# Altium schematic sheet Arduino FPGA Top-Level Interface.SchDoc
size A4
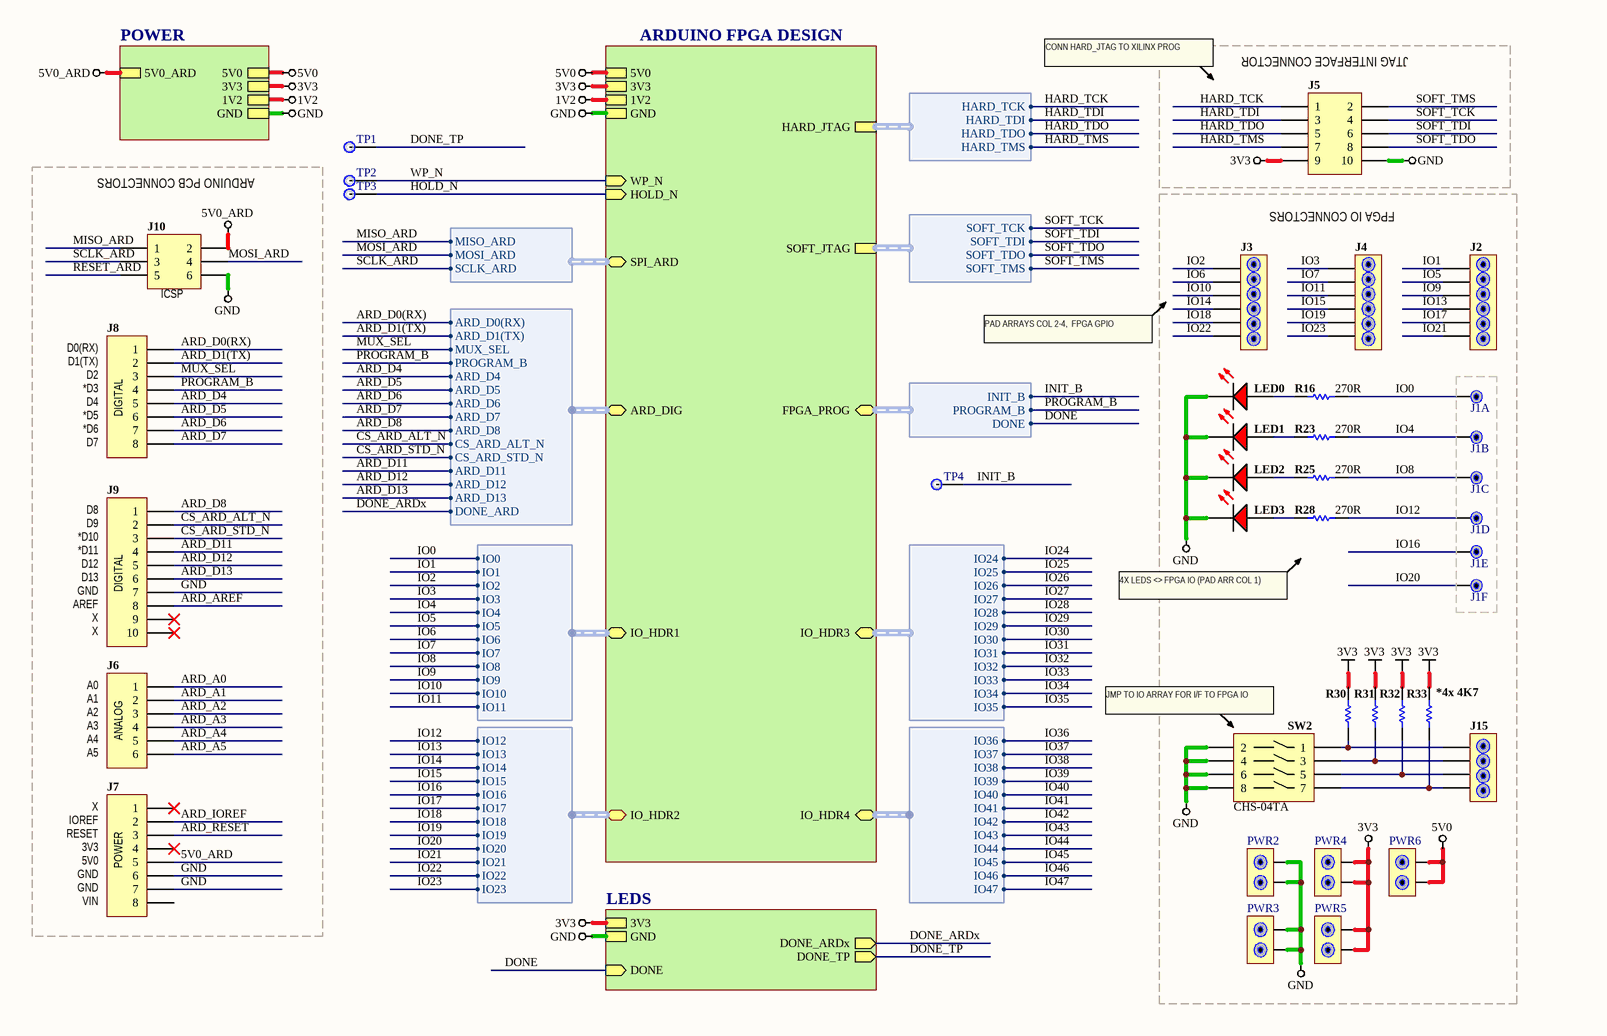
[diagram p0: Arduino FPGA Top-Level Interface.SchDoc]

## Parts
J1  HDR1X6X1  [HDR1X6]  (value not drawn)  (parts A,B,C,D,E,F of 6)
J2  6-POS VERTICAL HEADER  [HDR1X6]  (value not drawn)
J3  6-POS VERTICAL HEADER  [HDR1X6]  (value not drawn)
J4  6-POS VERTICAL HEADER  [HDR1X6]  (value not drawn)
J5  Header 5X2  [HDR2X5]  (value not drawn)
J6  Header 6  [1X06]  (value not drawn)
J7  Header 8  [1X08]  (value not drawn)
J8  Header 8  [1X08]  (value not drawn)
J9  Header 10  [1X10@1]  (value not drawn)
J10  Header 3X2  [2X03]  (value not drawn)
J15  4-POS VERTICAL HEADER  [HDR1X4]  (value not drawn)
LED0  0402-LED-RED  [LED_0402]  (value not drawn)
LED1  0402-LED-RED  [LED_0402]  (value not drawn)
LED2  0402-LED-RED  [LED_0402]  (value not drawn)
LED3  0402-LED-RED  [LED_0402]  (value not drawn)
PWR2  Jumper  [JMP1X2]  (value not drawn)
PWR3  Jumper  [JMP1X2]  (value not drawn)
PWR4  Jumper  [JMP1X2]  (value not drawn)
PWR5  Jumper  [JMP1X2]  (value not drawn)
PWR6  Jumper  [JMP1X2]  (value not drawn)
R16  value 270R  [RESC0402(1005)40_L]  (hidden comment: 270R 1 0402)
R23  value 270R  [RESC0402(1005)40_L]  (hidden comment: 270R 1 0402)
R25  value 270R  [RESC0402(1005)40_L]  (hidden comment: 270R 1 0402)
R28  value 270R  [RESC0402(1005)40_L]  (hidden comment: 270R 1 0402)
R30  4K7 1 0402  [RESC0402(1005)40_L]  (value not drawn)
R31  4K7 1 0402  [RESC0402(1005)40_L]  (value not drawn)
R32  4K7 1 0402  [RESC0402(1005)40_L]  (value not drawn)
R33  4K7 1 0402  [RESC0402(1005)40_L]  (value not drawn)
SW2  CHS-04TA  [CHS-04A1]
TP1  TESTPOINT_TH  [TESTPOINT_TH]  (value not drawn)
TP2  TESTPOINT_TH  [TESTPOINT_TH]  (value not drawn)
TP3  TESTPOINT_TH  [TESTPOINT_TH]  (value not drawn)
TP4  TESTPOINT_TH  [TESTPOINT_TH]  (value not drawn)

## Blocks framed on the sheet
JTAG INTERFACE CONNECTOR: J5
ARDUINO PCB CONNECTORS: J6-J10
FPGA IO CONNECTORS: J1-J4 J15 LED0-LED3 PWR2-PWR6 R16 R23 R25 R28 R30-R33 SW2

## Sub-sheets
ARDUINO FPGA DESIGN = Arduino FPGA Design.SchDoc: 3V3, GND, 1V2, HARD_JTAG (harness HARD_JTAG), SOFT_JTAG (harness SOFT_JTAG), WP_N (in), HOLD_N (in), IO_HDR2 (harness IO_HDR2), IO_HDR3 (harness IO_HDR3), IO_HDR4 (harness IO_HDR4), IO_HDR1 (harness IO_HDR1), FPGA_PROG (harness FPGA_PROGRAM), SPI_ARD (harness SPI_ARD), 5V0, ARD_DIG (harness ARD_DIG)
LEDS = LEDS - Status.SchDoc: GND, DONE (in), DONE_ARDx (out), DONE_TP (out), 3V3
POWER = Power - 5V0.SchDoc: 5V0, 3V3, 1V2, GND, 5V0_ARD

## Harnesses
HARD_JTAG: HARD_TCK, HARD_TDI, HARD_TDO, HARD_TMS
SOFT_JTAG: SOFT_TCK, SOFT_TDI, SOFT_TDO, SOFT_TMS
FPGA_PROGRAM: INIT_B, PROGRAM_B, DONE
SPI_ARD: MISO_ARD, MOSI_ARD, SCLK_ARD
IO_HDR1: IO0, IO1, IO2, IO3, IO4, IO5, IO6, IO7, IO8, IO9, IO10, IO11
IO_HDR3: IO24, IO25, IO26, IO27, IO28, IO29, IO30, IO31, IO32, IO33, IO34, IO35
IO_HDR4: IO36, IO37, IO38, IO39, IO40, IO41, IO42, IO43, IO44, IO45, IO46, IO47
IO_HDR2: IO12, IO13, IO16, IO17, IO18, IO19, IO20, IO21, IO22, IO23, IO14, IO15
ARD_DIG: ARD_D0(RX), ARD_D1(TX), MUX_SEL, PROGRAM_B, ARD_D4, ARD_D5, ARD_D6, ARD_D7, ARD_D8, CS_ARD_ALT_N, CS_ARD_STD_N, ARD_D11, ARD_D12, ARD_D13, DONE_ARD

## Nets
1V2: sheet ARDUINO FPGA DESIGN/1V2, sheet POWER/1V2
3V3: J5.9 PWR4.1 PWR4.2 PWR5.1 PWR5.2 R30.2 R31.2 R32.2 R33.2 ; sheet ARDUINO FPGA DESIGN/3V3, sheet POWER/3V3, sheet LEDS/3V3
5V0: PWR6.1 PWR6.2 ; sheet ARDUINO FPGA DESIGN/5V0, sheet POWER/5V0
5V0_ARD: J7.5 ; sheet POWER/5V0_ARD
GND: J5.10 J7.6 J7.7 J9.7 J10.6 LED0.2(K) LED1.2(K) LED2.2(K) LED3.2(K) PWR2.1 PWR2.2 PWR3.1 PWR3.2 SW2.2 SW2.4 SW2.6 SW2.8 ; sheet ARDUINO FPGA DESIGN/GND, sheet POWER/GND, sheet LEDS/GND
ARD_A0: J6.1
ARD_A1: J6.2
ARD_A2: J6.3
ARD_A3: J6.4
ARD_A4: J6.5
ARD_A5: J6.6
ARD_AREF: J9.8
ARD_D0(RX): J8.1 ; sheet ARDUINO FPGA DESIGN/ARD_DIG.ARD_D0(RX)
ARD_D1(TX): J8.2 ; sheet ARDUINO FPGA DESIGN/ARD_DIG.ARD_D1(TX)
ARD_D4: J8.5 ; sheet ARDUINO FPGA DESIGN/ARD_DIG.ARD_D4
ARD_D5: J8.6 ; sheet ARDUINO FPGA DESIGN/ARD_DIG.ARD_D5
ARD_D6: J8.7 ; sheet ARDUINO FPGA DESIGN/ARD_DIG.ARD_D6
ARD_D7: J8.8 ; sheet ARDUINO FPGA DESIGN/ARD_DIG.ARD_D7
ARD_D8: J9.1 ; sheet ARDUINO FPGA DESIGN/ARD_DIG.ARD_D8
ARD_D11: J9.4 ; sheet ARDUINO FPGA DESIGN/ARD_DIG.ARD_D11
ARD_D12: J9.5 ; sheet ARDUINO FPGA DESIGN/ARD_DIG.ARD_D12
ARD_D13: J9.6 ; sheet ARDUINO FPGA DESIGN/ARD_DIG.ARD_D13
ARD_IOREF: J7.2
ARD_RESET: J7.3
CS_ARD_ALT_N: J9.2 ; sheet ARDUINO FPGA DESIGN/ARD_DIG.CS_ARD_ALT_N
CS_ARD_STD_N: J9.3 ; sheet ARDUINO FPGA DESIGN/ARD_DIG.CS_ARD_STD_N
DONE: sheet LEDS/DONE, sheet ARDUINO FPGA DESIGN/FPGA_PROG.DONE
DONE_ARDx: sheet LEDS/DONE_ARDx, sheet ARDUINO FPGA DESIGN/ARD_DIG.DONE_ARD
DONE_TP: TP1.1 ; sheet LEDS/DONE_TP
HARD_TCK: J5.1 ; sheet ARDUINO FPGA DESIGN/HARD_JTAG.HARD_TCK
HARD_TDI: J5.3 ; sheet ARDUINO FPGA DESIGN/HARD_JTAG.HARD_TDI
HARD_TDO: J5.5 ; sheet ARDUINO FPGA DESIGN/HARD_JTAG.HARD_TDO
HARD_TMS: J5.7 ; sheet ARDUINO FPGA DESIGN/HARD_JTAG.HARD_TMS
HOLD_N: TP3.1 ; sheet ARDUINO FPGA DESIGN/HOLD_N
INIT_B: TP4.1 ; sheet ARDUINO FPGA DESIGN/FPGA_PROG.INIT_B
IO0: J1.1 R16.2 ; sheet ARDUINO FPGA DESIGN/IO_HDR1.IO0
IO1: J2.1 ; sheet ARDUINO FPGA DESIGN/IO_HDR1.IO1
IO2: J3.1 ; sheet ARDUINO FPGA DESIGN/IO_HDR1.IO2
IO3: J4.1 ; sheet ARDUINO FPGA DESIGN/IO_HDR1.IO3
IO4: J1.2 R23.2 ; sheet ARDUINO FPGA DESIGN/IO_HDR1.IO4
IO5: J2.2 ; sheet ARDUINO FPGA DESIGN/IO_HDR1.IO5
IO6: J3.2 ; sheet ARDUINO FPGA DESIGN/IO_HDR1.IO6
IO7: J4.2 ; sheet ARDUINO FPGA DESIGN/IO_HDR1.IO7
IO8: J1.3 R25.2 ; sheet ARDUINO FPGA DESIGN/IO_HDR1.IO8
IO9: J2.3 ; sheet ARDUINO FPGA DESIGN/IO_HDR1.IO9
IO10: J3.3 ; sheet ARDUINO FPGA DESIGN/IO_HDR1.IO10
IO11: J4.3 ; sheet ARDUINO FPGA DESIGN/IO_HDR1.IO11
IO12: J1.4 R28.2 ; sheet ARDUINO FPGA DESIGN/IO_HDR2.IO12
IO13: J2.4 ; sheet ARDUINO FPGA DESIGN/IO_HDR2.IO13
IO14: J3.4 ; sheet ARDUINO FPGA DESIGN/IO_HDR2.IO14
IO15: J4.4 ; sheet ARDUINO FPGA DESIGN/IO_HDR2.IO15
IO16: J1.5 ; sheet ARDUINO FPGA DESIGN/IO_HDR2.IO16
IO17: J2.5 ; sheet ARDUINO FPGA DESIGN/IO_HDR2.IO17
IO18: J3.5 ; sheet ARDUINO FPGA DESIGN/IO_HDR2.IO18
IO19: J4.5 ; sheet ARDUINO FPGA DESIGN/IO_HDR2.IO19
IO20: J1.6 ; sheet ARDUINO FPGA DESIGN/IO_HDR2.IO20
IO21: J2.6 ; sheet ARDUINO FPGA DESIGN/IO_HDR2.IO21
IO22: J3.6 ; sheet ARDUINO FPGA DESIGN/IO_HDR2.IO22
IO23: J4.6 ; sheet ARDUINO FPGA DESIGN/IO_HDR2.IO23
IO24: sheet ARDUINO FPGA DESIGN/IO_HDR3.IO24
IO25: sheet ARDUINO FPGA DESIGN/IO_HDR3.IO25
IO26: sheet ARDUINO FPGA DESIGN/IO_HDR3.IO26
IO27: sheet ARDUINO FPGA DESIGN/IO_HDR3.IO27
IO28: sheet ARDUINO FPGA DESIGN/IO_HDR3.IO28
IO29: sheet ARDUINO FPGA DESIGN/IO_HDR3.IO29
IO30: sheet ARDUINO FPGA DESIGN/IO_HDR3.IO30
IO31: sheet ARDUINO FPGA DESIGN/IO_HDR3.IO31
IO32: sheet ARDUINO FPGA DESIGN/IO_HDR3.IO32
IO33: sheet ARDUINO FPGA DESIGN/IO_HDR3.IO33
IO34: sheet ARDUINO FPGA DESIGN/IO_HDR3.IO34
IO35: sheet ARDUINO FPGA DESIGN/IO_HDR3.IO35
IO36: sheet ARDUINO FPGA DESIGN/IO_HDR4.IO36
IO37: sheet ARDUINO FPGA DESIGN/IO_HDR4.IO37
IO38: sheet ARDUINO FPGA DESIGN/IO_HDR4.IO38
IO39: sheet ARDUINO FPGA DESIGN/IO_HDR4.IO39
IO40: sheet ARDUINO FPGA DESIGN/IO_HDR4.IO40
IO41: sheet ARDUINO FPGA DESIGN/IO_HDR4.IO41
IO42: sheet ARDUINO FPGA DESIGN/IO_HDR4.IO42
IO43: sheet ARDUINO FPGA DESIGN/IO_HDR4.IO43
IO44: sheet ARDUINO FPGA DESIGN/IO_HDR4.IO44
IO45: sheet ARDUINO FPGA DESIGN/IO_HDR4.IO45
IO46: sheet ARDUINO FPGA DESIGN/IO_HDR4.IO46
IO47: sheet ARDUINO FPGA DESIGN/IO_HDR4.IO47
MISO_ARD: J10.1 ; sheet ARDUINO FPGA DESIGN/SPI_ARD.MISO_ARD
MOSI_ARD: J10.4 ; sheet ARDUINO FPGA DESIGN/SPI_ARD.MOSI_ARD
MUX_SEL: J8.3 ; sheet ARDUINO FPGA DESIGN/ARD_DIG.MUX_SEL
PROGRAM_B: J8.4 ; sheet ARDUINO FPGA DESIGN/FPGA_PROG.PROGRAM_B, sheet ARDUINO FPGA DESIGN/ARD_DIG.PROGRAM_B
RESET_ARD: J10.5
SCLK_ARD: J10.3 ; sheet ARDUINO FPGA DESIGN/SPI_ARD.SCLK_ARD
SOFT_TCK: J5.4 ; sheet ARDUINO FPGA DESIGN/SOFT_JTAG.SOFT_TCK
SOFT_TDI: J5.6 ; sheet ARDUINO FPGA DESIGN/SOFT_JTAG.SOFT_TDI
SOFT_TDO: J5.8 ; sheet ARDUINO FPGA DESIGN/SOFT_JTAG.SOFT_TDO
SOFT_TMS: J5.2 ; sheet ARDUINO FPGA DESIGN/SOFT_JTAG.SOFT_TMS
WP_N: TP2.1 ; sheet ARDUINO FPGA DESIGN/WP_N
NetJ15_1: J15.1 R30.1 SW2.1
NetJ15_2: J15.2 R31.1 SW2.3
NetJ15_3: J15.3 R32.1 SW2.5
NetJ15_4: J15.4 R33.1 SW2.7
NetLED0_1: LED0.1(A) R16.1
NetLED1_1: LED1.1(A) R23.1
NetLED2_1: LED2.1(A) R25.1
NetLED3_1: LED3.1(A) R28.1

Not connected (* = marked no-connect by the designer): J7 1* 4* 8; J9 9* 10*; J10 2

## Notes on the sheet
- CONN HARD_JTAG TO XILINX PROG
- (near J10) ICSP
- (near J8) D0(RX)
- (near J8) D1(TX)
- (near J8) D2
- PAD ARRAYS COL 2-4,  FPGA GPIO
- (near J8) *D3
- (near J8) D4
- (near J8) *D5
- (near J8) *D6
- (near J8) D7
- (near J8) DIGITAL
- (near J9) D8
- (near J9) D9
- (near J9) *D10
- (near J9) *D11
- (near J9) D12
- (near J9) D13
- (near J9) GND
- (near J9) AREF
- (near J9) X
- X
- (near J9) DIGITAL
- 4X LEDS <> FPGA IO (PAD ARR COL 1)
- A0
- (near J6) A1
- (near J6) A2
- (near SW2) JMP TO IO ARRAY FOR I/F TO FPGA IO
- (near R33) *4x 4K7
- (near J6) A3
- (near J6) A4
- A5
- (near J6) ANALOG
- (near J7) IOREF
- (near J7) RESET
- (near J7) 3V3
- (near J7) 5V0
- (near J7) GND
- (near J7) VIN
- (near J7) POWER
- Labels drawn without touching a wire or pin: 5V0_ARD

## Library data of the parts
J1 = HDR1X6X1: Manufacturer_PN: 68000-406HLF; Manufacturer Part Number: 68000-406HLF
J2-J4 = 6-POS-HDR: Manufacturer_PN: 68000-406HLF; Manufacturer Part Number: 68000-406HLF
J5 = Header 5X2: Header, 5-Pin, Dual row; Manufacturer_PN: 67997-210HLF; LatestRevisionDate: 17-Jul-2002; LatestRevisionNote: Re-released for DXP Platform.; Publisher: Altium Limited; Manufacturer Part Number: 67997-210HLF
J6 = Header 6: Header, 6-Pin; Manufacturer_PN: DNP; LatestRevisionDate: 17-Jul-2002; LatestRevisionNote: Re-released for DXP Platform.; Publisher: Altium Limited; Manufacturer Part Number: DNP
J7 J8 = Header 8: Header, 8-Pin; Manufacturer_PN: DNP; LatestRevisionDate: 17-Jul-2002; LatestRevisionNote: Re-released for DXP Platform.; Publisher: Altium Limited; Manufacturer Part Number: DNP
J9 = Header 10: Header, 10-Pin; Manufacturer_PN: DNP; LatestRevisionDate: 17-Jul-2002; LatestRevisionNote: Re-released for DXP Platform.; Publisher: Altium Limited; Manufacturer Part Number: DNP
J10 = Header 3X2: Header, 3-Pin, Dual row; Manufacturer_PN: DNP; LatestRevisionDate: 17-Jul-2002; LatestRevisionNote: Re-released for DXP Platform.; Publisher: Altium Limited; Manufacturer Part Number: DNP
J15 = 4-POS-HDR: Manufacturer_PN: 68000-404HLF; Manufacturer Part Number: 68000-404HLF
LED0-LED3 = CMP-0201-0013: 0402 LED,RED; Manufacturer_PN: LTST-C190KRKT; DefaultDesignator: LED?; Class: Diodes; Current Average (Io): 1.8V; ID: CMP-0201-0013; Sub Class: LED; Reverse Voltage DC (Vr): Red; ComponentLink1Description: Datasheet; ComponentLink1URL: http://optoelectronics.liteon.com/upload/download/DS-22-99-0151/S_110_LTST-C190KRKT.pdf; ComponentLink2Description: Manufacturer; ComponentLink2URL: http://www.liteon.com; Manufacturer Part Number: LTST-C190KRKT
PWR2-PWR6 = JMP1X2: Standard 2 Pin Jumper, 100mil spacing; Manufacturer_PN: M20-9770246; Manufacturer Part Number: M20-9770246
R16 R23 R25 R28 = CMP-0503-0059: 0402 (1005 Metric) 1/16 W 270R 1 Thick Film Chip Resistor; Manufacturer_PN: RC1005F271CS; Case-EIA: 0402; Case-Metric: 1005; Temp Coefficient ppm/°C: ±100; Tolerance %: 1%; Value (Ohms): 270; Power: 1/16 W; ID: CMP-0503-0059; Technology: SMT; Manufacturer Part Number: RC1005F271CS
R30-R33 = 0402 (1005 Metric) 1/16 W 4K7 1 Thick Film Chip Resistor: Manufacturer_PN: CR0402-FX-4701GLFDKR-ND; Case-EIA: 0402; Case-Metric: 1005; Power: 1/16 W; Temp Coefficient ppm/°C: ±100; Tolerance %: 1%; Value (Ohms): 4700; Value: 4K7; Technology: SMT; Manufacturer Part Number: CR0402-FX-4701GLFDKR-ND
SW2 = CHS-04TA: SWITCH DIP 4-POS SLIDE SMD 6V; Manufacturer: Copal Electronics Inc; Circuit: SPST; Number of Positions: 4; Contact Rating @ Voltage: 0.1A @ 6VDC; Actuator Type: Standard; Actuator Level: Flush; Washable: Yes; Supplier 1: Digi-Key; Manufacturer Part Number: CHS-04TA; RoHS: RoHS Compliant; Category: Switches; Stock 1: 2000; Pricing 1: 500=1.33876, 1000=1.1475, 5000=1.05188 (USD); Mounting Type: Surface Mount; Orientation: Top Actuated; ComponentLink1URL: http://copal-electronics.info/en/0008e/0267f.pdf; ComponentLink1Description: http://copal-electronics.info/en/0008e/0267f.pdf; Supplier Part Number 1: 563-1007-2-ND; Manufacturer_PN: CHS-04TA
TP1-TP4 = TESTPOINT_TH: Manufacturer_PN: TESTPOINT; Manufacturer Part Number: TESTPOINT